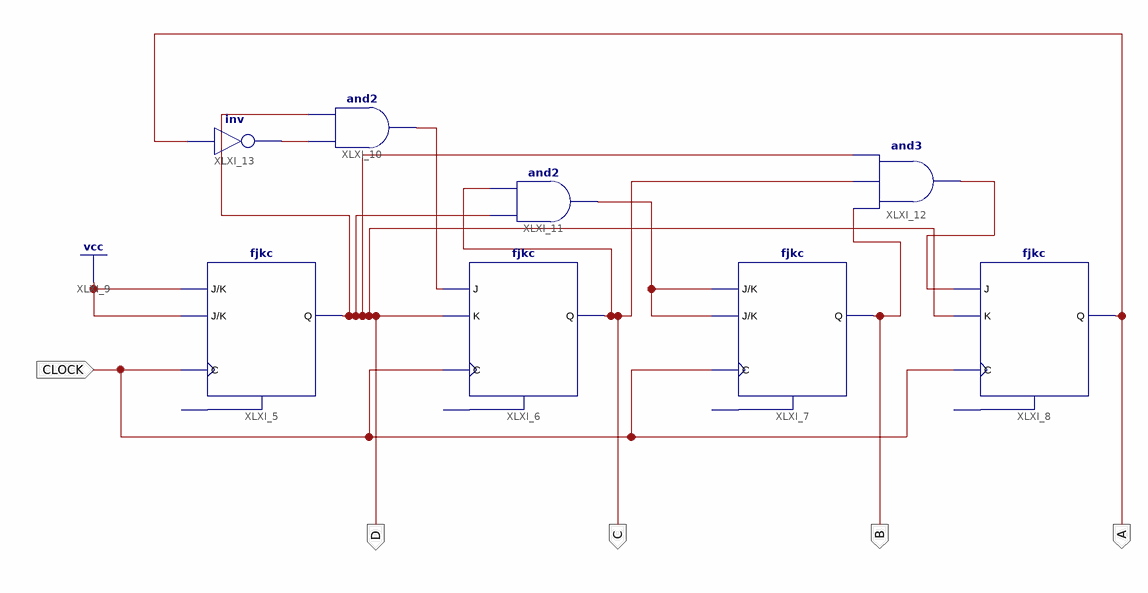
[diagram p0: schematic sheet 1]
// Xilinx ISE schematic counter09.sch (spartan6) as structural Verilog: 8 symbols, 5 ports
module counter09 (
  input  CLOCK,
  output A,
  output C,
  output B,
  output D
);

  wire XLXN_6, XLXN_11, XLXN_22, XLXN_26;

  fjkc XLXI_5 (.C(CLOCK), .J(1'b1), .K(1'b1), .Q(D));  // open: CLR
  fjkc XLXI_6 (.C(CLOCK), .J(XLXN_11), .K(D), .Q(C));  // open: CLR
  fjkc XLXI_7 (.C(CLOCK), .J(XLXN_22), .K(XLXN_22), .Q(B));  // open: CLR
  fjkc XLXI_8 (.C(CLOCK), .J(XLXN_26), .K(D), .Q(A));  // open: CLR
  and XLXI_10 (XLXN_11, XLXN_6, D);
  and XLXI_11 (XLXN_22, D, C);
  and XLXI_12 (XLXN_26, B, C, D);
  not XLXI_13 (XLXN_6, A);

  // Notes on the sheet:
  //   CLOCK_DEDICATED_ROUTE on signal CLOCK = TRUE
endmodule
